# EAGLE design MiiScoreBoard (EAGLE 7.7.0)
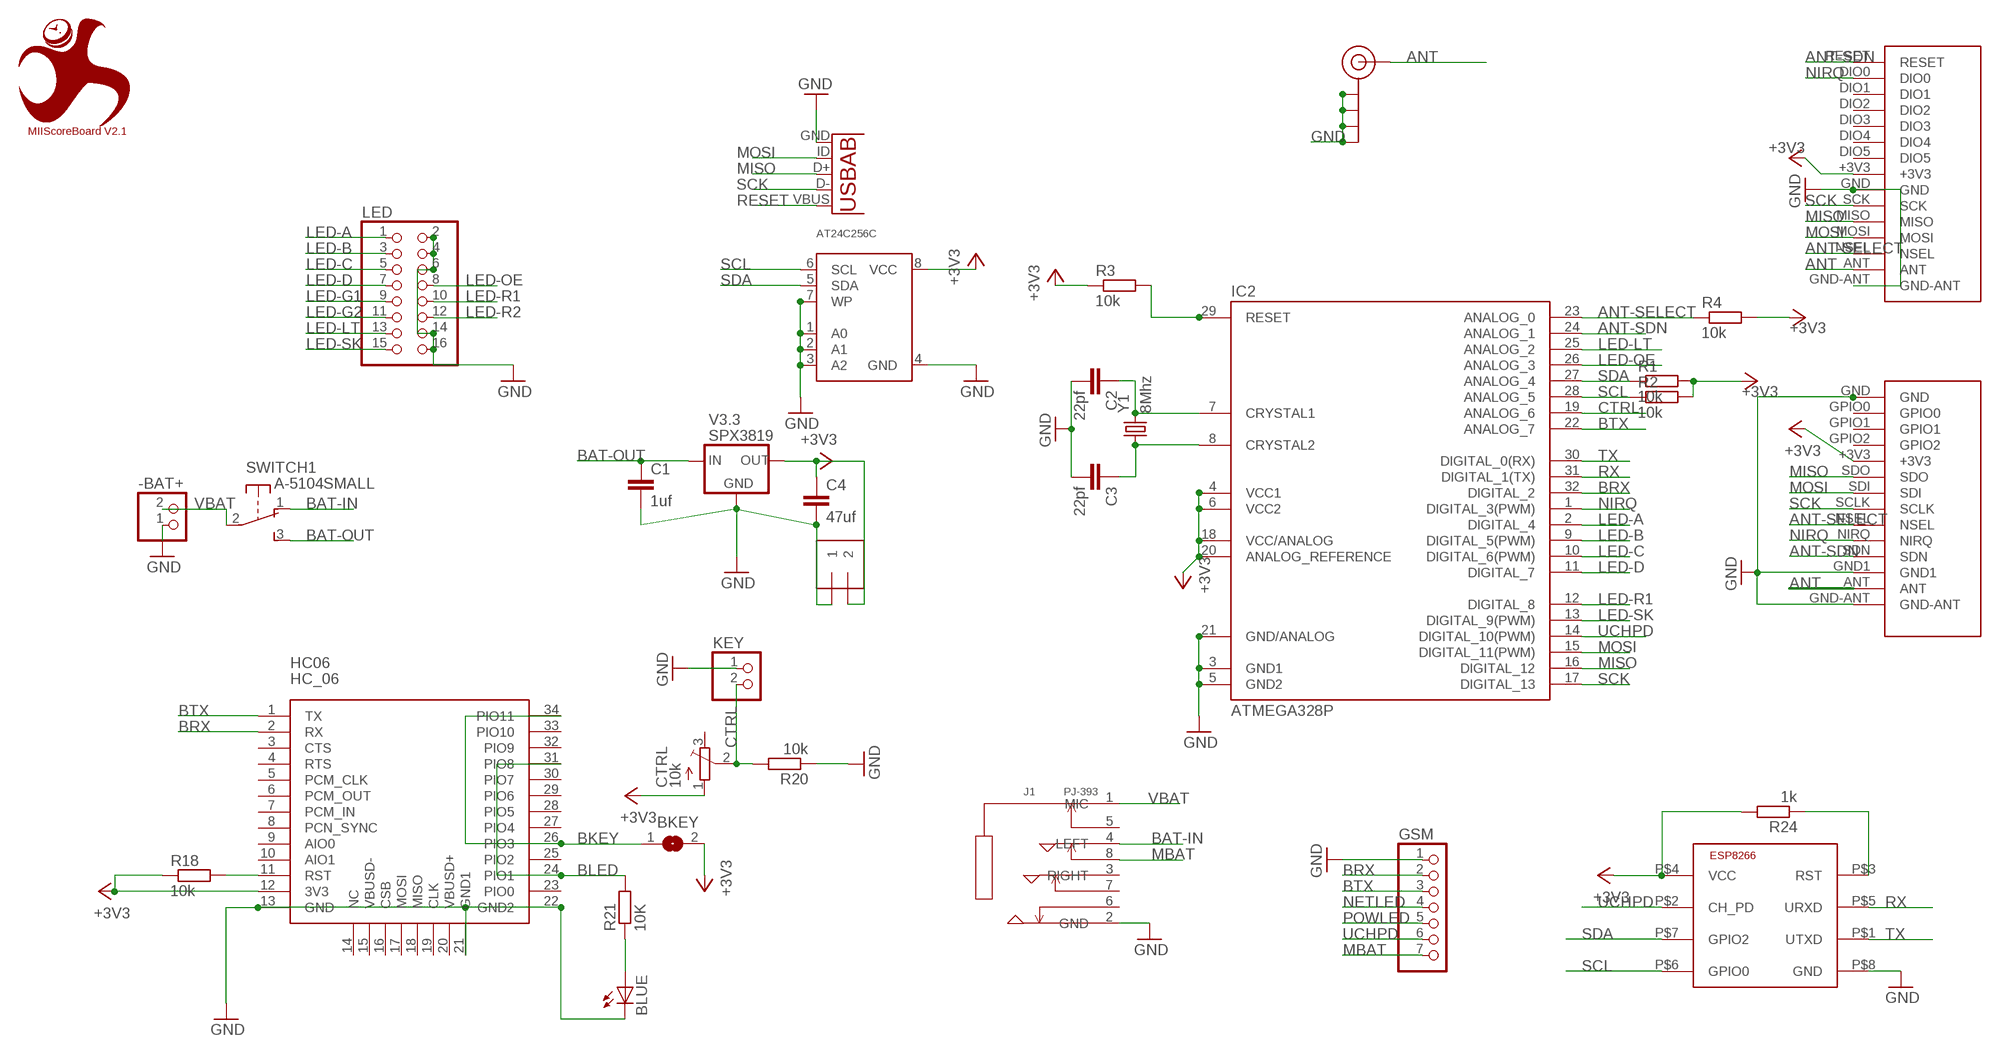
[diagram p0: schematic, sheet 1]

## Parts
-BAT+  JST_2PIN-THM  [JST-PH-2-THM]
-LED+  -BAT+  1X2-3.5MM  [1X2-3.5MM]
AT24C256C  EEPROM_I2C_SOIC8_GENERIC  [SOIC8_150MIL]
BKEY  SOLDERJUMPER  [SOLDERJUMPER_ARROW_NOPASTE]
BLUE  LEDCHIP-LED0805  [CHIP-LED0805]
C1  1uf  C-EUC0805  [C0805]
C2  22pf  C-EUC0805  [C0805]
C3  22pf  C-EUC0805  [C0805]
C4  47uf  C-EUC0805  [C0805]
CTRL  10k  TRIMPOTTC33X  [TC33X]
GSM  PINHD-1X07_2.54  [1X07]
HC06  HC_06  HC_05  [BLUETOOTH_SMD]
IC2  ATMEGA328P  ATMEGA168-AU  [TQFP32-08]
ISP1  USB-ABUSB_SIERK  [USB_AB_MICRO_SJH]
J1  PJ-393  AUDIO-JACK-PJ-393(8P-SMD)  [AUDIO8P-SMD-3.5-14.5X6.1X4.0MM]
J$1  SMA_EDGE  [SMA-EDGE]
KEY  PINHD-1X02_2.54-90°  [1X02/90]
LED  PINHD-2X08_2.54  [2X08]
R1  10k  R-EU_R0805  [R0805]
R2  10k  R-EU_R0805  [R0805]
R3  10k  R-EU_R0805  [R0805]
R4  10k  R-EU_R0805  [R0805]
R18  10k  R-EU_R0805  [R0805]
R20  10k  R-EU_R0805  [R0805]
R21  10K  R-EU_R0805  [R0805]
R24  1k  R-EU_R0805  [R0805]
SWITCH  A-5104SMALL  [A-5104-SMALL]
U$1  MIIScoreBoard V2.1  MIICHRONO  [MIICHRONO]
U$2  DRF1278F  [DRF1278F]
U$6  ESP8266-01  [ESP-01]
U$7  SI4432  SPI4432  [SI4432]
V3.3  SPX3819  [SOT23-5]
Y1  8Mhz  CRYSTALSMD  [HC49UP]

## Nets
+3V3 [supply]: -LED+.2 AT24C256C.8(VCC) BKEY.2 C4.1 CTRL.1(A) HC06.12(3V3) IC2.4(VCC1) IC2.6(VCC2) IC2.18(VCC/ANALOG) IC2.20(ANALOG_REFERENCE) R1.2 R2.2 R3.1 R4.2 R18.1 R24.2 U$2.+3V3 U$6.P$4(VCC) U$7.+3V3 V3.3.5(OUT)
ANT [antenna]: J$1.$P1(SIGNAL) U$2.ANT U$7.ANT
ANT-SDN: IC2.24(ANALOG_1) U$2.RESET U$7.SDN
ANT-SELECT: IC2.23(ANALOG_0) R4.1 U$2.NSEL U$7.NSEL
BAT-IN [supply]: J1.4(LEFT) SWITCH.1(1:O)
BAT-OUT [supply]: C1.1 SWITCH.3(1:S) V3.3.1(IN) V3.3.3(IN)
BKEY: BKEY.1 HC06.26(PIO3) HC06.34(PIO11)
BLED: HC06.24(PIO1) HC06.31(PIO8) R21.2
BRX: GSM.2 HC06.2(RX) IC2.32(DIGITAL_2)
BTX: GSM.3 HC06.1(TX) IC2.22(ANALOG_7)
CTRL: CTRL.2(S) IC2.19(ANALOG_6) KEY.2 R20.2
GND [supply]: -BAT+.1 -LED+.1 AT24C256C.1(A0) AT24C256C.2(A1) AT24C256C.3(A2) AT24C256C.4(GND) AT24C256C.7(WP) BLUE.C C1.2 C2.2 C3.2 C4.2 GSM.1 HC06.13(GND) HC06.21(GND1) HC06.22(GND2) IC2.3(GND1) IC2.5(GND2) IC2.21(GND/ANALOG) ISP1.GND J1.2(GND) J$1.GND@0(GND) J$1.GND@1(GND) J$1.GND@2(GND) J$1.GND@3(GND) KEY.1 LED.2 LED.4 LED.6 LED.14 LED.16 R20.1 U$2.GND U$2.GND-ANT U$6.P$8(GND) U$7.GND U$7.GND1 U$7.GND-ANT V3.3.2(GND)
LED-A: IC2.2(DIGITAL_4) LED.1
LED-B: IC2.9(DIGITAL_5(PWM)) LED.3
LED-C: IC2.10(DIGITAL_6(PWM)) LED.5
LED-D: IC2.11(DIGITAL_7) LED.7
LED-G1: LED.9
LED-G2: LED.11
LED-LT: IC2.25(ANALOG_2) LED.13
LED-OE: IC2.26(ANALOG_3) LED.8
LED-R1: IC2.12(DIGITAL_8) LED.10
LED-R2: LED.12
LED-SK: IC2.13(DIGITAL_9(PWM)) LED.15
MBAT: GSM.7 J1.8
MISO: IC2.16(DIGITAL_12) ISP1.D+ U$2.MISO U$7.SDO
MOSI: IC2.15(DIGITAL_11(PWM)) ISP1.ID(USBID) U$2.MOSI U$7.SDI
N$3: HC06.11(RST) R18.2
N$8: C3.1 IC2.8(CRYSTAL2) Y1.1
N$9: C2.1 IC2.7(CRYSTAL1) Y1.2
N$12: R24.1 U$6.P$3(RST)
N$15: BLUE.A R21.1
NETLED: GSM.4
NIRQ: IC2.1(DIGITAL_3(PWM)) U$2.DIO0 U$7.NIRQ
POWLED: GSM.5
RESET: IC2.29(RESET) ISP1.VBUS R3.2
RX: IC2.31(DIGITAL_1(TX)) U$6.P$5(URXD)
SCK: IC2.17(DIGITAL_13) ISP1.D- U$2.SCK U$7.SCLK
SCL: AT24C256C.6(SCL) IC2.28(ANALOG_5) R2.1 U$6.P$6(GPIO0)
SDA: AT24C256C.5(SDA) IC2.27(ANALOG_4) R1.1 U$6.P$7(GPIO2)
TX: IC2.30(DIGITAL_0(RX)) U$6.P$1(UTXD)
UCHPD: GSM.6 IC2.14(DIGITAL_10(PWM)) U$6.P$2(CH_PD)
VBAT [supply]: -BAT+.2 J1.1(MIC) SWITCH.2(1:P)
Unconnected: CTRL.3(E) HC06.3(CTS) HC06.4(RTS) HC06.5(PCM_CLK) HC06.6(PCM_OUT) HC06.7(PCM_IN) HC06.8(PCN_SYNC) HC06.9(AIO0) HC06.10(AIO1) HC06.14(NC) HC06.15(VBUSD-) HC06.16(CSB) HC06.17(MOSI) HC06.18(MISO) HC06.19(CLK) HC06.20(VBUSD+) HC06.23(PIO0) HC06.25(PIO2) HC06.27(PIO4) HC06.28(PIO5) HC06.29(PIO6) HC06.30(PIO7) HC06.32(PIO9) HC06.33(PIO10) J1.3(RIGHT) J1.5 J1.6 J1.7 SWITCH.MT1(MT) SWITCH.MT2(MT) U$2.DIO1 U$2.DIO2 U$2.DIO3 U$2.DIO4 U$2.DIO5 U$7.GPIO0 U$7.GPIO1 U$7.GPIO2

## Library data of the parts
-BAT+ = adafruit:JST_2PIN: JST 2-Pin Connectors of various flavors SMT-RA (S2B-PH-SM4) 4UConnector #17311 SMT (B2B-PH-SM4) THM-RA (S2B-PH) THM (B2B-PH)
-LED+ = adafruit:1X2: 3.5mm Terminal block http://www.ladyada.net/library/pcb/eaglelibrary.html
AT24C256C = microbuilder:EEPROM_I2C_SOIC8_GENERIC: Note: The same pinout is used for many I2C EEPROMs in SOIC8(150mil) from a variety of manufacturers and in various sizes. Examples: 16K (2K x 8 Bit) I2C EEPROM 1.7-5.5V, 400KHz, -40°C-85°C Digikey: CAT24C16WI-GT3CT-ND 256K (32K x 8 Bit) I2C EEPROM 1.7-5.5V, 400KHz, -40°C-85°C Digikey: 24AA256-I/SN-ND
BKEY = microbuilder:SOLDERJUMPER: SMD Solder JUMPER Solder the two pads together to create a connection, or remove the solder to break it. REFLOW - Use this footprint for solder paste and reflow ovens. WAVE - Use this footprint for hand-soldering (larger pads). CLOSED - Has a trace between the two pads to ensure it is closed by default. The trace needs to be cut to disable the jumper, and can be closed again by creating a solder bridge between the two pads.; BOM: EXCLUDE
BLUE = adafruit:LED: LED OSRAM: - CHIPLED LG R971, LG N971, LY N971, LG Q971, LY Q971, LO R971, LY R971 LH N974, LH R974 LS Q976, LO Q976, LY Q976 LO Q996 - Hyper CHIPLED LW Q18S LB Q993, LB Q99A, LB R99A - SideLED LS A670, LO A670, LY A670, LG A670, LP A670 LB A673, LV A673, LT A673, LW A673 LH A674 LY A675 LS A676, LA A676, LO A676, LY A676, LW A676 LS A679, LY A679, LG A679 - Hyper Micro SIDELED® LS Y876, LA Y876, LO Y876, LY Y876 LT Y87S - SmartLED LW L88C, LW L88S LB L89C, LB L89S, LG L890 LS L89K, LO L89K, LY L89K LS L896, LA L896, LO L896, LY L896 - TOPLED LS T670, LO T670, LY T670, LG T670, LP T670 LSG T670, LSP T670, LSY T670, LOP T670, LYG T670 LG T671, LOG T671, LSG T671 LB T673, LV T673, LT T673, LW T673 LH T674 LS T676, LA T676, LO T676, LY T676, LB T676, LH T676, LSB T676, LW T676 LB T67C, LV T67C, LT T67C, LS T67K, LO T67K, LY T67K, LW E67C LS E67B, LA E67B, LO E67B, LY E67B, LB E67C, LV E67C, LT E67C LW T67C LS T679, LY T679, LG T679 LS T770, LO T770, LY T770, LG T770, LP T770 LB T773, LV T773, LT T773, LW T773 LH T774 LS E675, LA E675, LY E675, LS T675 LS T776, LA T776, LO T776, LY T776, LB T776 LHGB T686 LT T68C, LB T68C - Hyper Mini TOPLED® LB M676 - Mini TOPLED Santana® LG M470 LS M47K, LO M47K, LY M47K Source: http://www.osram.convergy.de/
C1-C4 = rcl:C-EU: CAPACITOR, European symbol
CTRL = MyLib:TRIMPOT: SMT trimmer potentiometer part number TC33X http://www.ladyada.net/library/eagle
GSM = pinhead-2:PINHD-1X07: PIN HEADER
HC06 = SerialPortBluetooth:HC_05
IC2 = Arduino-AVR:ATMEGA168
ISP1 = MyLib:USB-AB: This is a USB AB connector that is compatible with USB OTG. i.e. this connector can serve as a host or device
J1 = MyLib:AUDIO-JACK-PJ-393(8P-SMD): 320040009; MPN: PJ-393
J$1 = MyLib:SMA_EDGE: SMA Antenna Connector End launch SMA connector. The paste layer has been removed so that the connector can be hand soldered onto the board after reflow.
KEY = pinhead-2:PINHD-1X02: PIN HEADER
LED = pinhead-2:PINHD-2X08: PIN HEADER
R1-R4 R18 R20 R24 = rcl:R-EU_: RESISTOR, European symbol
R21 = rcl:R-EU_: RESISTOR, European symbol; NOTE: WAS 120
SWITCH = MyLib:A-5104: E-Switch right-angle slide SPDT Ebay and taydaElectronics A-5014
U$1 = MyLib:MIICHRONO
U$2 = MyLib:DRF1278F
U$6 = ESP8266-01-03:ESP8266-01: ESP8266 - ESP-01 Module
U$7 = MyLib:SPI4432
V3.3 = PMIC:SPX3819
Y1 = SparkFun:CRYSTAL: Crystals Various standard crystals. Proven footprints. Spark Fun Electronics SKU : COM-00534

## Net classes
0 default: width 0.203 mm
1 supply: width 0.254 mm
2 antenna: width 0.381 mm, clearance 0.203 mm

## Board
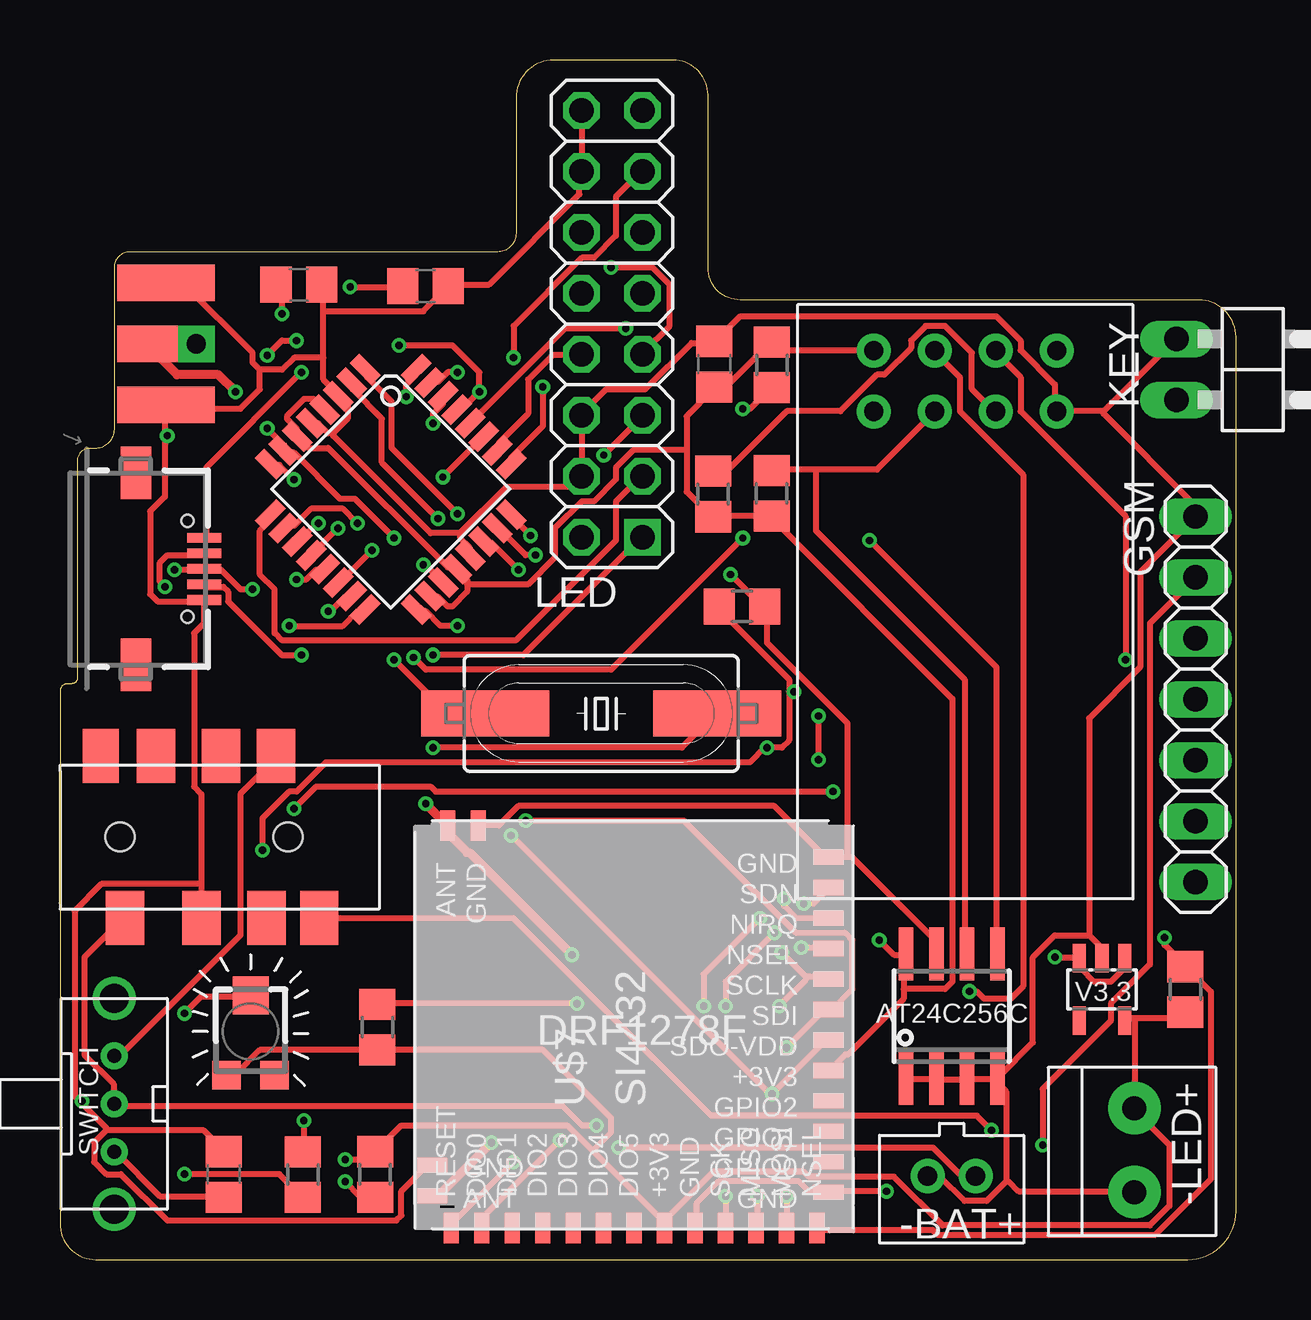
[diagram p1: board, top side]
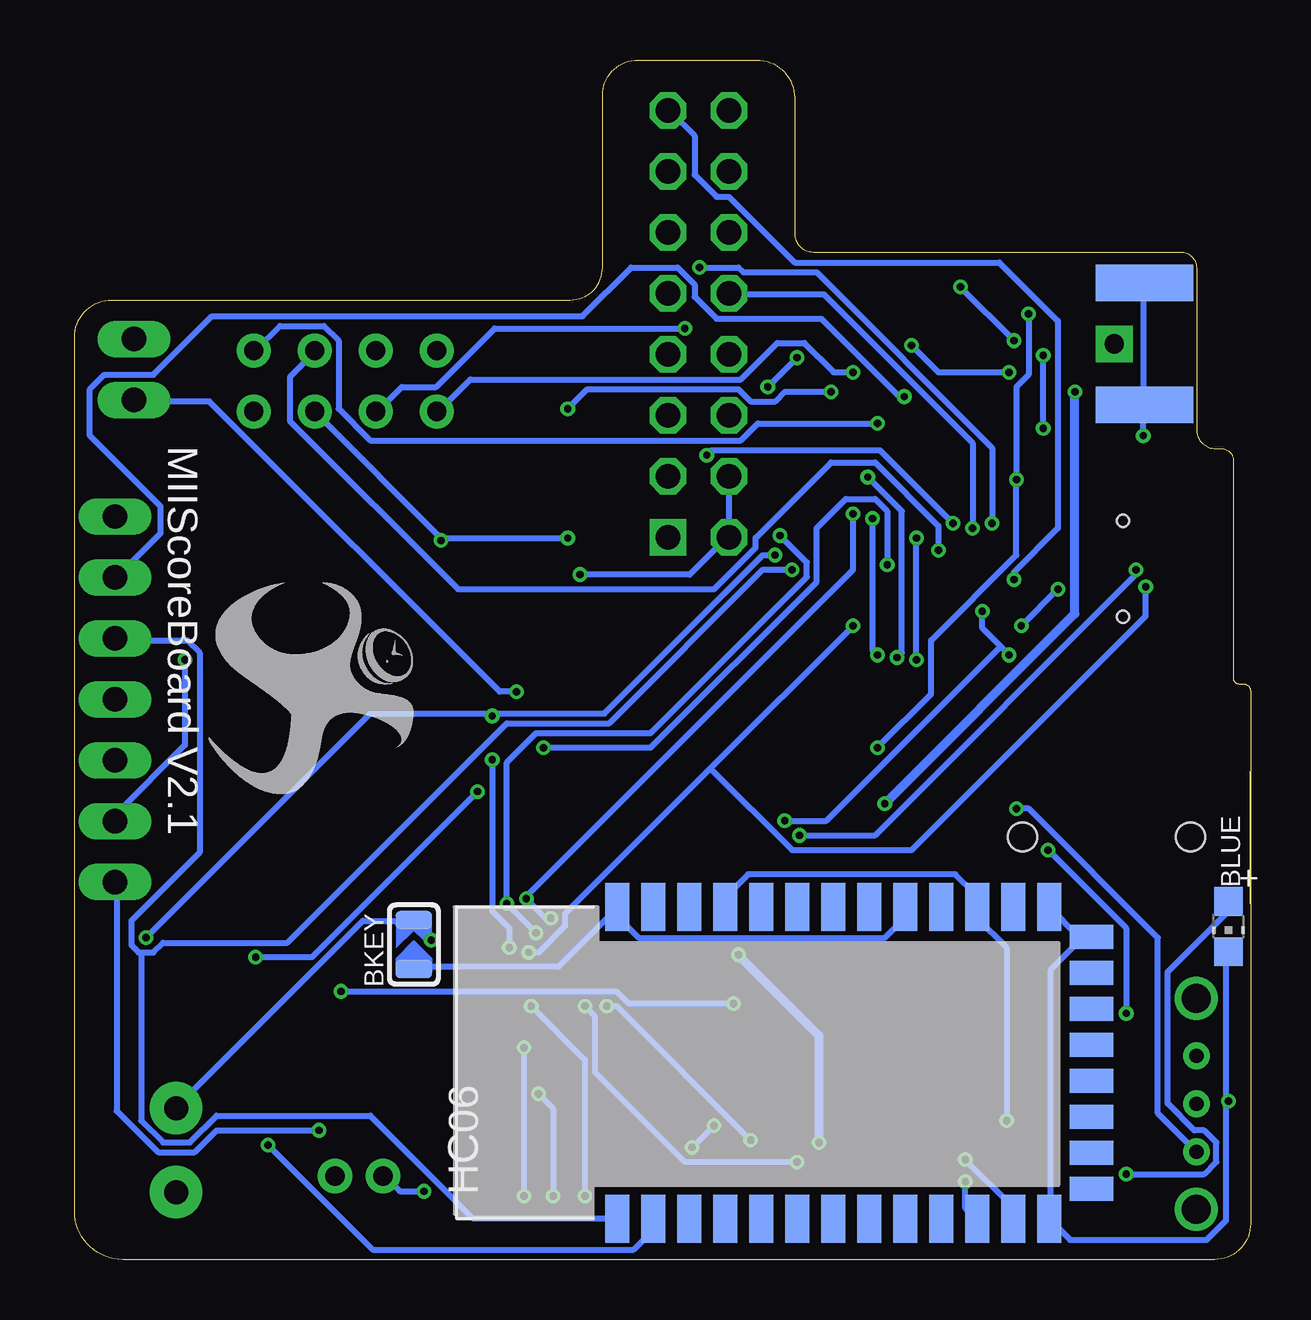
[diagram p2: board, bottom side, seen from below]

Size 49 x 50 mm. Coordinates in mm from the lower left corner, seen from the top.
Outline: 1.5,0 46.99,0 arc90 49,2.01 49,38.44 arc90 47.44,40 28.34,40 arc-90 27,41.34 27,48.53 arc90 25.53,50 20.58,50 arc90 19,48.42 19,42.78 arc-90 18.22,42 2.92,42 arc90 2.25,41.33 2.25,34.6 arc-90 1.45,33.8 1.21,33.8 arc90 0.72,33.31 0.72,24.23 arc-90 0.49,24 0.31,24 arc90 0,23.69 0,1.5 arc90 1.5,0
Copper layers (1*16): Top 0.035mm / dielectric 1.5mm / Bottom 0.035mm
Design rules "SierkSeed *": minimum track width 10mil, minimum drill 12mil, track to track 6mil, track to pad 6mil, pad to pad 6mil, via to via 6mil, smd to smd 0mil, copper to edge 10mil, drill to drill 10mil, minimum pad ring 10mil, minimum via ring 6mil, stop-mask expansion 2mil, vias tented up to drill 100mil, thermal gap 10mil

### Footprints (pad centres in the part's own frame; a part is rotated, then mirrored left to right if it is on the bottom)
JST-PH-2-THM = drill 0.8 pad 1.422: 1 1,0; 2 -1,0
1X2-3.5MM = drill 1 pad 2.184: 1 1.8,0; 2 -1.7,0
SOIC8_150MIL = smd 0.6 x 2.2: 1 -1.905,-2.6; 2 -0.635,-2.6; 3 0.635,-2.6; 4 1.905,-2.6; 5 1.905,2.6; 6 0.635,2.6; 7 -0.635,2.6; 8 -1.905,2.6
SOLDERJUMPER_ARROW_NOPASTE = smd 0.762 x 1.524: 1 -1.016,0; 2 1.016,0
CHIP-LED0805 = smd 1.2 x 1.2: A 0,-1.05; C 0,1.05
C0805 = smd 1.3 x 1.5: 1 -0.95,0; 2 0.95,0
TC33X = smd 1.2 x 1.2: 1 -1,-1.825; 3 1,-1.825 | smd 1.5 x 1.6: 2 0,1.5
1X07 = drill 1.016 long: 1 -7.62,0; 2 -5.08,0; 3 -2.54,0; 4 0,0; 5 2.54,0; 6 5.08,0; 7 7.62,0
BLUETOOTH_SMD = smd 2 x 1: 1 0,0; 2 0,-1.5; 3 0,-3; 4 0,-4.5; 5 0,-6; 6 0,-7.5; 7 0,-9; 8 0,-10.5; 9 0,-12; 10 0,-13.5; 11 0,-15; 12 0,-16.5; 13 0,-18; 22 13,-18; 23 13,-16.5; 24 13,-15; 25 13,-13.5; 26 13,-12; 27 13,-10.5; 28 13,-9; 29 13,-7.5; 30 13,-6; 31 13,-4.5; 32 13,-3; 33 13,-1.5; 34 13,0 | smd 1 x 1.8: 14 1.25,-19.75; 15 2.75,-19.75; 16 4.25,-19.75; 17 5.75,-19.75; 18 7.25,-19.75; 19 8.75,-19.75; 20 10.25,-19.75; 21 11.75,-19.75
TQFP32-08 = smd 1.27 x 0.559: 1 -4.293,2.8; 2 -4.293,2; 3 -4.293,1.2; 4 -4.293,0.4; 5 -4.293,-0.4; 6 -4.293,-1.2; 7 -4.293,-2; 8 -4.293,-2.8; 17 4.293,-2.8; 18 4.293,-2; 19 4.293,-1.2; 20 4.293,-0.4; 21 4.293,0.4; 22 4.293,1.2; 23 4.293,2; 24 4.293,2.8 | smd 0.559 x 1.27: 9 -2.8,-4.293; 10 -2,-4.293; 11 -1.2,-4.293; 12 -0.4,-4.293; 13 0.4,-4.293; 14 1.2,-4.293; 15 2,-4.293; 16 2.8,-4.293; 25 2.8,4.293; 26 2,4.293; 27 1.2,4.293; 28 0.4,4.293; 29 -0.4,4.293; 30 -1.2,4.293; 31 -2,4.293; 32 -2.8,4.293
USB_AB_MICRO_SJH = smd 1.4 x 0.4: D+ 2.85,0; D- 2.85,0.65; GND 2.85,-1.3; ID 2.85,-0.65; VBUS 2.85,1.3 | smd 1.27 x 2.2: P$8 0,4; P$9 0,-4 | hole 0.5: 2.15,2; 2.15,-2
AUDIO8P-SMD-3.5-14.5X6.1X4.0MM = smd 1.6 x 2.25: 1 3.9,-3.375; 2 7.1,-3.375; 3 9.8,-3.375; 4 10.2,3.375; 6 5.2,3.375; 7 7.9,3.375; 8 12,-3.375 | smd 1.5 x 2.25: 5 2.9,3.375 | hole 1.2: 3.7,0; 10.7,0
SMA-EDGE = smd 1.524 x 2.54: $P1 2.54,0.762 | smd 1.524 x 4.064: GND@0 0,0; GND@1 5.08,0 | smd 1.524 x 4.064 bottom: GND@2 0,0; GND@3 5.08,0 | drill 0.8 pad 1.524 square: SIG 2.54,-1.27
1X02/90 = drill 1.016 long: 1 -2.54,-3.81; 2 0,-3.81
2X08 = drill 1.016 square: 1 -8.89,-1.27 | drill 1.016 octagon: 2 -8.89,1.27; 3 -6.35,-1.27; 4 -6.35,1.27; 5 -3.81,-1.27; 6 -3.81,1.27; 7 -1.27,-1.27; 8 -1.27,1.27; 9 1.27,-1.27; 10 1.27,1.27; 11 3.81,-1.27; 12 3.81,1.27; 13 6.35,-1.27; 14 6.35,1.27; 15 8.89,-1.27; 16 8.89,1.27
R0805 = smd 1.3 x 1.5: 1 -0.95,0; 2 0.95,0
A-5104-SMALL = drill 0.6: 1 -2,0; 2 0,0; 3 2,0 | drill 1.2: MT1 -4.4,0; MT2 4.4,0
DRF1278F = smd 0.635 x 1.27: +3V3 0.24,-7.62; ANT -8.79,9.144; DIO0 -7.38,-7.62; DIO1 -6.11,-7.62; DIO2 -4.84,-7.62; DIO3 -3.57,-7.62; DIO4 -2.3,-7.62; DIO5 -1.03,-7.62; GND 1.51,-7.62; GND-ANT -7.52,9.144; MISO 4.05,-7.62; MOSI 5.32,-7.62; NSEL 6.59,-7.62; RESET -8.65,-7.62; SCK 2.78,-7.62
ESP-01 = drill 0.8 pad 1.422: P$1 0,0; P$2 2.54,0; P$3 5.08,0; P$4 7.62,0; P$5 7.62,2.54; P$6 5.08,2.54; P$7 2.54,2.54; P$8 0,2.54
SI4432 = smd 0.635 x 1.27: +3V3 6.59,0; ANT 1.37,16.51; GND 1.51,0; GND1 15.48,0; GND-ANT 2.64,16.51; GPIO0 2.78,0; GPIO1 4.05,0; GPIO2 5.32,0; NIRQ 12.94,0; NSEL 11.67,0; SCLK 10.4,0; SDI 9.13,0; SDN 14.21,0; SDO 7.86,0
SOT23-5 = smd 1.2 x 0.55: 1 1.3,-0.95; 2 1.3,0; 3 1.3,0.95; 4 -1.3,0.95; 5 -1.3,-0.95
HC49UP = smd 5.334 x 1.93: 1 -4.826,0; 2 4.826,0

### Placement (x,y rotation side)
-BAT+  37.15,3.48 180 top
-LED+  44.77,4.61 270 top
AT24C256C  37.15,10.14 0 top
BKEY  34.86,13.13 90 bottom
BLUE  0.92,13.88 180 bottom
C1  6.82,3.55 90 top
C2  15.23,40.57 0 top
C3  9.95,40.63 0 top
C4  27.26,37.32 90 top
CTRL  7.94,9.51 0 top
GSM  47.32,23.35 270 top
HC06  26.38,1.7 90 bottom
IC2  13.78,32.11 315 top
ISP1  3.16,28.79 0 top
J1  -1.2,17.61 0 top
J$1  4.41,35.63 90 top
KEY  50.33,35.83 270 top
LED  23,39 90 top
R1  27.21,31.91 270 top
R2  29.65,31.94 270 top
R3  29.66,37.29 270 top
R4  46.89,11.26 270 top
R18  13.13,3.55 270 top
R20  28.42,27.22 180 top
R21  10.12,3.54 90 top
R24  13.22,9.69 270 top
SWITCH  2.26,6.49 270 top
U$1  43.42,28.23 270 bottom
U$2  24.95,8.93 0 top
U$6  41.53,37.89 180 top
U$7  32.02,1.29 90 top
V3.3  43.42,11.26 90 top
Y1  22.55,22.76 180 top

### Tracks (layer width: path | path; a pad name or v marks a point on that pad's centre or on a via)
+3V3  (via drill 0.3)
  Top 0.254: CTRL.1 7.01,7.72 7.32,7.72 8.33,8.74 13.21,8.74 R24.2 13.31,8.74 20.12,8.74 22.96,5.89 22.96,5.28 22.2,4.52 | 22.2,4.52 21.13,5.59 14.22,5.59 13.21,4.57 R18.1 13.01,4.47 12.7,4.17 v11.89,4.17 | 22.2,4.52 25.09,1.63 25.09,1.32 U$2.+3V3 25.2,1.63 27.23,3.66 30.99,3.66 31.19,3.45 34.75,3.45 36.78,1.42 45.41,1.42 46.23,2.23 46.23,4.78 44.81,6.2 -LED+.2 44.81,6.4 44.81,10.06 | 35.15,11.28 35.15,12.7 AT24C256C.8 35.05,12.7 34.75,12.7 v34.14,13.31 | 35.15,11.28 35.15,10.87 32.82,8.53 32.72,8.53 32.11,7.92 U$7.+3V3 | 44.81,10.06 46.63,10.06 46.84,10.26 R4.2 | 44.81,10.06 44.4,10.06 V3.3.5 | 16.97,28.14 16.97,28.35 16.56,28.75 IC2.20 16.46,28.85 16.15,28.85 11.18,33.83 10.36,33.83 9.96,34.24 IC2.6 9.86,34.34 9.86,34.65 9.45,35.05 9.45,35.15 10.16,35.87 10.57,35.87 10.97,35.46 IC2.4 | 16.97,28.14 16.97,27.84 16.36,27.23 16.15,27.23 15.75,27.64 15.44,27.64 IC2.18 | 26.11,33.73 26.11,35.15 27.23,36.27 C4.1 27.33,36.37 27.74,36.37 29.57,38.2 R3.1 29.77,38.2 30.07,37.9 33.83,37.9 U$6.P$4 | 26.11,33.73 26.11,32 27.13,30.99 R1.2 27.23,30.99 29.57,30.99 R2.2 29.67,30.89 37.19,23.37 37.19,11.58 36.88,11.28 35.15,11.28 | 16.97,28.14 19.51,28.14 20.62,29.26 20.62,30.48 21.74,31.6 22.25,31.6 23.16,32.51 23.16,33.02 23.88,33.73 26.11,33.73
  Bottom 0.254: v11.89,4.17 9.96,2.23 9.96,1.73 HC06.12 | -LED+.2 44.7,6.4 36.98,14.12 34.95,14.12 BKEY.2 34.85,14.02 v34.14,13.31
ANT  (via drill 0.3)
  Top 0.381: v17.98,4.88 15.85,2.74 15.54,2.74 U$7.ANT | v21.34,12.7 17.07,16.97 16.97,16.97 16.26,17.68 16.26,17.98 U$2.ANT 16.05,18.19 v15.24,19 | v7.32,36.17 6.6,36.88 4.88,36.88 3.66,38.1 J$1.$P1
  Bottom 0.381: v17.98,4.88 17.98,9.35 v21.34,12.7 | v7.32,36.17 7.32,26.92 v15.24,19
ANT-SDN  (via drill 0.3)
  Top 0.254: v18.9,4.06 16.36,1.52 16.36,1.32 U$2.RESET | v27.74,10.57 27.74,11.58 v29.77,13.61 | v30.99,14.83 31.39,14.83 32,15.44 U$7.SDN | v19.61,30.18 18.8,30.99 IC2.24
  Bottom 0.254: v18.9,4.06 23.57,4.06 27.33,7.82 27.33,10.16 v27.74,10.57 | v29.77,13.61 v30.99,14.83 30.99,20.73 29.77,21.95 24.99,21.95 18.49,28.45 18.49,29.06 v19.61,30.18
ANT-SELECT  (via drill 0.3)
  Top 0.254: U$2.NSEL 31.6,1.22 36.37,1.22 36.58,1.02 45.62,1.02 47.95,3.35 47.95,11.18 46.94,12.19 R4.1 46.84,12.29 46.02,13.11 v46.02,13.41 | v19.81,29.36 19.41,29.36 18.29,30.48 IC2.23 | v30.89,13.01 32,13.01 U$7.NSEL | v31.6,22.66 v31.6,20.83
  Bottom 0.254: v19.81,29.36 20.32,29.36 26.92,22.76 31.6,22.76 | 31.6,22.76 36.68,22.76 v46.02,13.41 | v30.89,13.01 30.89,13.82 31.6,14.53 v31.6,20.83 | v31.6,22.66 31.6,22.76
BAT-IN
  Top 0.254: SWITCH.1 2.34,8.53 2.54,8.53 7.52,13.51 7.52,19.41 9.04,20.93 J1.4
BAT-OUT  (via drill 0.3)
  Top 0.254: V3.3.1 44.3,12.5 44.3,12.09 43.79,11.58 43.08,11.58 42.57,12.09 42.57,12.5 V3.3.3 42.37,12.6 v41.45,12.6 | C1.1 6.81,2.64 4.17,2.64 2.34,4.47 SWITCH.3 | v32.21,19.51 15.65,19.51 15.44,19.71 10.67,19.71 v9.75,18.8
  Bottom 0.254: v41.45,12.6 39.12,12.6 v32.21,19.51 | v9.75,18.8 9.25,18.8 3.86,13.41 3.86,6.1 2.34,4.57 SWITCH.3
BKEY
  Bottom 0.254: BKEY.1 34.85,12.19 28.85,12.19 26.42,14.63 HC06.34 26.52,14.43 25.5,13.41 15.24,13.41 14.43,14.22 14.43,14.63 HC06.26
BLED  (via drill 0.3)
  Top 0.254: v10.16,5.79 10.16,4.57 R21.2
  Bottom 0.254: v10.16,5.79 10.16,13.01 11.38,14.22 11.38,14.63 HC06.24 11.48,14.73 11.48,15.24 12.29,16.05 20.93,16.05 21.84,15.14 21.84,14.73 HC06.31
BRX  (via drill 0.3)
  Top 0.254: v14.43,35.97 14.43,36.47 14.83,36.88 14.83,37.08 IC2.32 | v40.95,4.78 40.95,7.11 43.79,9.96 43.79,10.67 45.41,12.29 45.41,26.52 47.24,28.35 GSM.2
  Bottom 0.254: v14.43,35.97 14.63,35.97 17.88,39.22 22.25,39.22 23.16,40.13 23.16,40.64 23.88,41.35 25.81,41.35 27.84,39.32 43.28,39.32 45.72,36.88 47.75,36.88 48.36,36.27 48.36,34.34 45.41,31.39 45.41,30.28 47.24,28.45 GSM.2 | v40.95,4.78 36.58,0.41 25.7,0.41 24.89,1.22 24.89,1.63 HC06.2
BTX  (via drill 0.3)
  Top 0.254: v19.1,28.75 17.98,29.87 17.68,29.87 IC2.22
  Bottom 0.254: v19.1,28.75 20.32,28.75 26.72,22.35 30.99,22.35 40.13,13.21 45.31,13.21 45.72,12.8 46.23,12.8 | 46.23,12.8 46.33,12.8 46.63,13.11 46.63,14.12 43.79,16.97 43.79,25.3 44.3,25.81 47.24,25.81 GSM.3 | 46.23,12.8 46.23,5.79 45.31,4.88 44.2,4.88 43.08,5.99 36.68,5.99 32.41,1.73 26.42,1.73 HC06.1
CTRL  (via drill 0.3)
  Top 0.254: v15.14,28.96 15.24,28.96 15.95,28.25 IC2.19 | 30.38,23.67 30.38,24.18 27.43,27.13 R20.2 | 30.38,23.67 30.38,21.64 30.07,21.34 v29.46,21.34 29.36,21.34 28.75,20.73 11.07,20.73 9.86,19.51 9.55,19.51 8.43,18.39 v8.43,17.07 | v5.18,10.26 5.89,10.97 7.92,10.97 CTRL.2 | v30.58,23.67 30.38,23.67
  Bottom 0.254: v15.14,28.96 15.14,31.19 15.65,31.7 16.87,31.7 18.09,30.48 18.09,28.25 24.99,21.34 v29.46,21.34 | v5.18,10.26 5.18,13.82 v8.43,17.07 | v30.58,23.67 31.29,23.67 43.38,35.76 46.43,35.76 KEY.2
GND  (via drill 0.3)
  Top 0.254: LED.16 21.74,47.85 21.74,45.41 LED.14 21.64,45.31 21.64,44.4 17.88,40.64 16.26,40.64 C2.2 16.15,40.54 15.14,39.52 10.97,39.52 | 11.38,34.44 11.18,34.44 10.77,34.85 10.46,34.85 IC2.5 | 11.38,34.44 11.99,35.05 11.99,35.66 11.68,35.97 IC2.3 11.58,36.07 10.97,36.68 10.97,37.59 | 10.97,37.59 10.97,39.52 | 10.97,39.52 10.97,40.54 C3.2 | 8.33,37.08 8.03,37.39 8.03,37.8 5.18,40.64 4.47,40.64 J$1.GND@3 | 8.33,37.08 9.25,37.08 9.75,37.59 10.97,37.59 | 1.93,5.38 1.42,4.88 1.42,4.06 1.93,3.56 2.54,3.56 4.47,1.63 14.02,1.63 14.22,1.83 14.22,2.85 15.24,3.86 15.44,3.86 U$7.GND-ANT | 1.93,5.38 5.99,5.38 6.81,4.57 C1.2 | 4.37,34.34 4.37,35.56 J$1.GND@2 4.47,35.46 7.52,35.46 8.33,36.27 8.33,37.08 | 4.37,34.34 4.37,31.8 3.76,31.19 3.76,27.74 4.06,27.43 5.99,27.43 ISP1.GND 5.99,27.33 5.99,26.52 5.59,26.11 5.59,19.71 5.89,19.41 5.89,15.65 | 5.89,15.65 5.89,14.33 J1.2 | v4.47,34.34 4.37,34.34 | 0.86,6.55 0.61,6.81 0.61,14.53 1.73,15.65 5.89,15.65 | 0.86,6.55 1.93,5.49 1.93,5.38 | v0.91,6.6 0.86,6.55 | 32.82,16.76 33.02,16.76 36.47,13.31 36.47,12.8 AT24C256C.7 | 32.82,16.76 32.11,16.76 U$7.GND1 31.9,16.76 29.77,18.9 19.1,18.9 18.29,18.09 17.48,18.09 U$2.GND-ANT | 32.82,16.76 32.82,22.35 29.46,25.7 29.46,27.13 R20.1 29.26,27.23 v27.94,28.55 | U$2.GND 26.52,1.32 26.52,2.34 27.43,3.25 30.79,3.25 31.19,2.85 32,2.85 U$7.GND 32.11,2.85 v34.44,2.85 | AT24C256C.1 35.26,7.52 36.47,7.52 AT24C256C.2 36.58,7.52 37.69,7.52 AT24C256C.3 37.9,7.52 39.01,7.52 AT24C256C.4 | 42.88,13.51 43.38,13.01 43.38,12.6 V3.3.2 | 42.88,13.51 41.45,13.51 40.54,12.6 40.54,9.04 39.12,7.62 AT24C256C.4
  Top 0.254: 39.42,3.25 38.61,2.44 37.69,2.44 36.68,3.45 36.17,3.45 -BAT+.1 | 39.42,3.25 39.42,7.01 39.01,7.42 AT24C256C.4 | -LED+.1 44.7,2.85 39.93,2.85 39.52,3.25 39.42,3.25 | 43.48,35.36 41.55,35.36 U$6.P$8 41.45,35.46 41.45,36.47 40.03,37.9 40.03,38.3 39.01,39.32 28.35,39.32 27.33,38.3 C4.2 27.23,38.2 26.31,38.2 24.38,36.27 22.76,36.27 21.74,35.26 LED.6 21.74,35.15 21.74,32.72 LED.4 21.64,32.61 21.23,32.21 18.59,32.21 16.66,30.28 | 43.48,35.36 46.43,38.3 KEY.1 | 43.48,35.36 43.48,35.26 47.24,31.5 47.24,30.99 GSM.1 47.24,30.89 45.01,28.65 45.01,24.69 42.88,22.55 42.88,13.51 | 16.66,30.28 16.66,30.07 17.07,29.67 17.07,29.36 IC2.21 | 16.66,30.28 15.44,30.28 11.38,34.34 11.38,34.44
  Bottom 0.254: HC06.22 8.33,14.63 7.21,13.51 6.71,13.51 HC06.21 7.21,13.41 7.21,13.21 8.33,12.09 8.33,1.73 HC06.13 8.33,1.63 7.52,0.81 1.83,0.81 1.02,1.63 1.02,6.6 | 1.02,6.6 1.02,12.8 BLUE.C | J$1.GND@3 4.47,40.64 4.47,35.66 J$1.GND@2 4.47,35.56 v4.47,34.34 | v0.91,6.6 1.02,6.6 | v34.44,2.85 35.46,2.85 36.07,3.45 -BAT+.1 | LED.4 21.74,32.61 21.74,30.18 LED.2 21.84,30.07 23.37,28.55 v27.94,28.55
LED-A  (via drill 0.3)
  Top 0.254: v15.75,30.89 13.41,33.22 13.41,35.05 12.19,36.27 12.19,36.47 IC2.2 | v15.54,25.2 19.3,25.2 24.18,30.07 LED.1
  Bottom 0.254: v15.75,30.89 15.75,25.4 v15.54,25.2
LED-B
  Top 0.254: IC2.9 8.74,30.99 8.74,30.79 8.33,30.38 8.33,28.55 8.94,27.94 8.94,26.11 9.25,25.81 19,25.81 23.16,29.97 23.16,31.6 24.18,32.61 LED.3
LED-C  (via drill 0.3)
  Top 0.254: v12.39,30.68 11.79,31.29 10.46,31.29 9.75,30.58 9.35,30.58 IC2.10 | v22.66,33.53 24.28,35.15 LED.5
  Bottom 0.254: v12.39,30.68 15.44,33.73 22.45,33.73 v22.66,33.53
LED-D  (via drill 0.3)
  Top 0.254: v10.77,30.68 10.67,30.68 9.96,29.97 IC2.11 | v22.96,41.35 24.69,41.35 25.4,40.64 25.4,38.91 24.28,37.8 LED.7
  Bottom 0.254: v10.77,30.68 10.77,33.83 18.09,41.15 21.13,41.15 21.34,41.35 v22.96,41.35
LED-LT  (via drill 0.3)
  Top 0.254: v20.12,36.37 20.12,34.75 18.8,33.43 18.8,33.22 IC2.25 | v18.9,37.59 18.9,38.91 21.74,41.76 22.25,41.76 23.16,42.67 23.16,44.3 24.18,45.31 LED.13
  Bottom 0.254: v18.9,37.59 v20.12,36.37
LED-OE
  Top 0.254: IC2.26 18.29,33.73 18.29,34.04 19.51,35.26 19.51,36.68 20.52,37.69 21.64,37.69 LED.8
LED-R1  (via drill 0.3)
  Top 0.254: v11.58,30.48 10.46,29.36 IC2.12
  Bottom 0.254: v11.58,30.48 11.58,34.04 17.78,40.23 21.64,40.23 LED.10
LED-SK  (via drill 0.3)
  Top 0.254: v9.86,28.35 10.26,28.35 10.67,28.75 10.97,28.75 IC2.13
  Bottom 0.254: v9.86,28.35 9.86,28.65 8.03,30.48 8.03,39.12 10.46,41.55 19,41.55 21.74,44.3 22.25,44.3 23.16,45.21 23.16,46.84 24.18,47.85 LED.15
MBAT  (via drill 0.3)
  Top 0.254: v38.81,5.38 38.2,5.99 27.13,5.99 18.9,14.22 10.87,14.22 J1.8
  Bottom 0.254: v38.81,5.38 43.08,5.38 43.99,4.47 45.52,4.47 47.24,6.2 47.24,15.65 GSM.7
MISO  (via drill 0.3)
  Top 0.254: v9.55,26.42 11.79,26.42 12.39,27.03 12.7,27.03 IC2.16 | v8.03,27.94 7.52,27.94 6.71,28.75 6.1,28.75 ISP1.D+ 5.89,28.75 v4.78,28.75 | v29.06,2.64 29.06,1.32 U$2.MISO | U$7.SDO 32,9.25 v29.67,6.91 29.57,6.91 v18.8,17.68
  Bottom 0.254: v8.03,27.94 v9.55,26.42 | v29.06,2.64 29.06,6.3 v29.67,6.91 | v4.78,28.75 4.78,28.55 15.65,17.68 v18.8,17.68
MOSI  (via drill 0.3)
  Top 0.254: v11.18,27.03 11.28,27.03 11.89,27.64 12.09,27.64 IC2.15 | v10.06,25.2 9.25,25.2 7.01,27.43 7.01,27.84 6.81,28.04 6.1,28.04 ISP1.ID | v30.28,2.64 U$2.MOSI | v30.28,8.84 31.8,10.36 32,10.36 U$7.SDI 32.11,10.36 33.02,11.28 33.02,13.31 32.72,13.61 30.68,13.61 26.01,18.29 v19.41,18.29
  Bottom 0.254: v11.18,27.03 11.18,26.31 10.41,25.55 | v10.06,25.2 10.41,25.55 | v30.28,8.84 v30.28,2.64 | 10.41,25.55 17.68,18.29 v19.41,18.29
N$3  (via drill 0.3)
  Top 0.254: v11.89,3.25 12.5,2.64 13.11,2.64 R18.2
  Bottom 0.254: v11.89,3.25 11.89,2.13 11.48,1.73 HC06.11
N$8  (via drill 0.3)
  Top 0.254: v9.75,32.51 9.14,33.12 8.84,33.12 IC2.8 | v9.25,39.42 9.25,40.34 9.04,40.54 C3.1 | v15.54,21.34 25.91,21.34 27.33,22.76 Y1.1
  Bottom 0.254: v9.25,39.42 9.25,36.88 9.75,36.37 v9.75,32.51 9.75,29.36 13.31,25.81 13.31,23.57 v15.54,21.34
N$9  (via drill 0.3)
  Top 0.254: v13.92,30.07 12.29,31.7 11.68,31.7 9.75,33.63 9.35,33.63 IC2.7 9.35,33.83 9.35,33.93 v8.64,34.65 | v13.92,24.99 16.05,22.86 17.68,22.86 Y1.2 | v12.09,40.54 14.22,40.54 C2.1 | v9.86,38.3 9.25,38.3 v8.64,37.69
  Bottom 0.254: v13.92,24.99 v13.92,30.07 | v9.86,38.3 v12.09,40.54 | v8.64,34.65 v8.64,37.69
N$12  (via drill 0.3)
  Top 0.254: v21.54,10.67 13.31,10.67 R24.1 | v37.9,11.18 38.2,11.18 38.51,10.87 39.62,10.87 40.13,11.38 40.13,32.72 37.49,35.36 37.49,36.78 36.47,37.8 U$6.P$3
  Bottom 0.254: v21.54,10.67 25.91,10.67 26.42,11.18 v37.9,11.18
N$15  (via drill 0.3)
  Top 0.254: v5.18,3.56 9.14,3.56 10.06,2.64 R21.1
  Bottom 0.254: v5.18,3.56 1.93,3.56 1.42,4.06 1.42,4.88 1.93,5.38 2.34,5.38 3.45,6.5 3.45,11.99 1.02,14.43 1.02,14.83 BLUE.A
NIRQ  (via drill 0.3)
  Top 0.254: v20.83,4.98 17.58,1.73 U$2.DIO0 | v26.82,10.57 26.82,11.89 v29.16,14.22 | v30.18,15.04 30.18,14.73 30.68,14.22 32,14.22 U$7.NIRQ | v16.56,31.09 13.82,33.83 13.82,35.76 12.8,36.78 12.8,37.08 IC2.1
  Bottom 0.254: v20.83,4.98 26.42,10.57 v26.82,10.57 | v29.16,14.22 29.36,14.22 v30.18,15.04 30.18,15.14 16.56,28.75 v16.56,31.09
RESET  (via drill 0.3)
  Top 0.254: v28.45,35.46 28.75,35.46 29.57,36.27 R3.2 | IC2.29 16.56,35.46 16.76,35.46 v17.48,36.17 17.48,36.98 16.36,38.1 v14.12,38.1 | v10.06,36.98 6.1,33.02 6.1,30.18 ISP1.VBUS
  Bottom 0.254: v17.48,36.17 19.41,36.17 19.81,35.76 20.83,35.76 21.34,36.27 27.64,36.27 v28.45,35.46 | v10.06,36.98 13.01,36.98 v14.12,38.1
RX  (via drill 0.3)
  Top 0.254: v16.56,36.98 16.15,36.98 15.75,36.58 15.44,36.58 IC2.31
  Bottom 0.254: v16.56,36.98 17.37,36.98 18.59,38.2 19.71,38.2 21.23,36.68 32.51,36.68 33.83,35.36 U$6.P$5
SCK  (via drill 0.3)
  Top 0.254: v16.56,26.42 15.85,26.42 15.24,27.03 14.94,27.03 IC2.17 | 31.09,11.79 v30.07,12.8 | 31.09,11.79 32,11.79 U$7.SCLK | v27.74,2.64 U$2.SCK | v29.97,10.57 31.09,11.68 31.09,11.79 | v4.37,28.04 4.17,28.25 4.17,29.06 4.47,29.36 5.99,29.36 ISP1.D-
  Bottom 0.254: 22.5,20.47 28.55,14.43 28.55,13.92 29.67,12.8 v30.07,12.8 | 22.5,20.47 v16.56,26.42 | v27.74,2.64 27.74,8.33 v29.97,10.57 | v4.37,28.04 4.37,26.82 14.12,17.07 19.1,17.07 22.5,20.47
SCL  (via drill 0.3)
  Top 0.254: v23.57,38.81 21.03,38.81 17.17,34.95 IC2.28 | 31.5,32.92 34.04,32.92 36.37,35.26 U$6.P$6 | 31.5,32.92 29.67,32.92 R2.1 | 31.5,32.92 31.5,30.38 37.69,24.18 37.69,12.8 AT24C256C.6
  Bottom 0.254: v23.57,38.81 31.5,38.81 33.93,36.37 35.36,36.37 36.37,35.36 U$6.P$6
SDA  (via drill 0.3)
  Top 0.254: v15.95,32.61 17.58,34.24 IC2.27 | v14.73,25.09 15.24,24.59 22.96,24.59 v28.45,30.07 | R1.1 27.23,32.92 27.84,32.92 30.28,35.36 32.51,35.36 34.04,36.88 34.34,36.88 35.46,38 35.46,38.3 36.07,38.91 36.88,38.91 38,37.8 38,36.27 38.91,35.36 U$6.P$7 | v33.73,29.97 39.01,24.69 39.01,12.8 AT24C256C.5
  Bottom 0.254: v15.95,32.61 14.53,31.19 14.53,25.3 v14.73,25.09 | 33.73,30.07 v28.45,30.07 | 33.73,30.07 38.91,35.26 U$6.P$7 | v33.73,29.97 33.73,30.07
TX  (via drill 0.3)
  Top 0.254: v15.54,34.85 15.54,35.26 15.95,35.66 15.95,35.97 IC2.30
  Bottom 0.254: v15.54,34.85 20.52,34.85 21.23,34.14 36.68,34.14 38,35.46 38,38.3 38.61,38.91 40.44,38.91 41.45,37.9 U$6.P$1
UCHPD  (via drill 0.3)
  Top 0.254: v13.01,29.57 11.68,28.25 IC2.14 | v44.4,24.99 44.4,30.99 40.03,35.36 40.03,36.78 39.01,37.8 U$6.P$2
  Bottom 0.254: v13.01,29.57 13.01,30.58 15.65,33.22 17.48,33.22 20.62,30.07 20.62,29.67 22.35,27.94 33.02,27.94 40.03,34.95 40.03,36.78 39.01,37.8 U$6.P$2 | v44.4,24.99 44.4,21.44 47.24,18.59 47.24,18.29 GSM.6
VBAT  (via drill 0.3)
  Top 0.254: J1.1 2.64,14.22 1.02,12.6 1.02,8.53 2.23,7.32 2.23,6.5 SWITCH.2 2.34,6.4 20.93,6.4 21.74,5.59 v22.35,5.59 | v23.27,4.67 36.37,4.67 37.49,3.56 38.1,3.56 -BAT+.2
  Bottom 0.254: v22.35,5.59 v23.27,4.67